# EAGLE design vco1_pots (EAGLE 7.4.0)
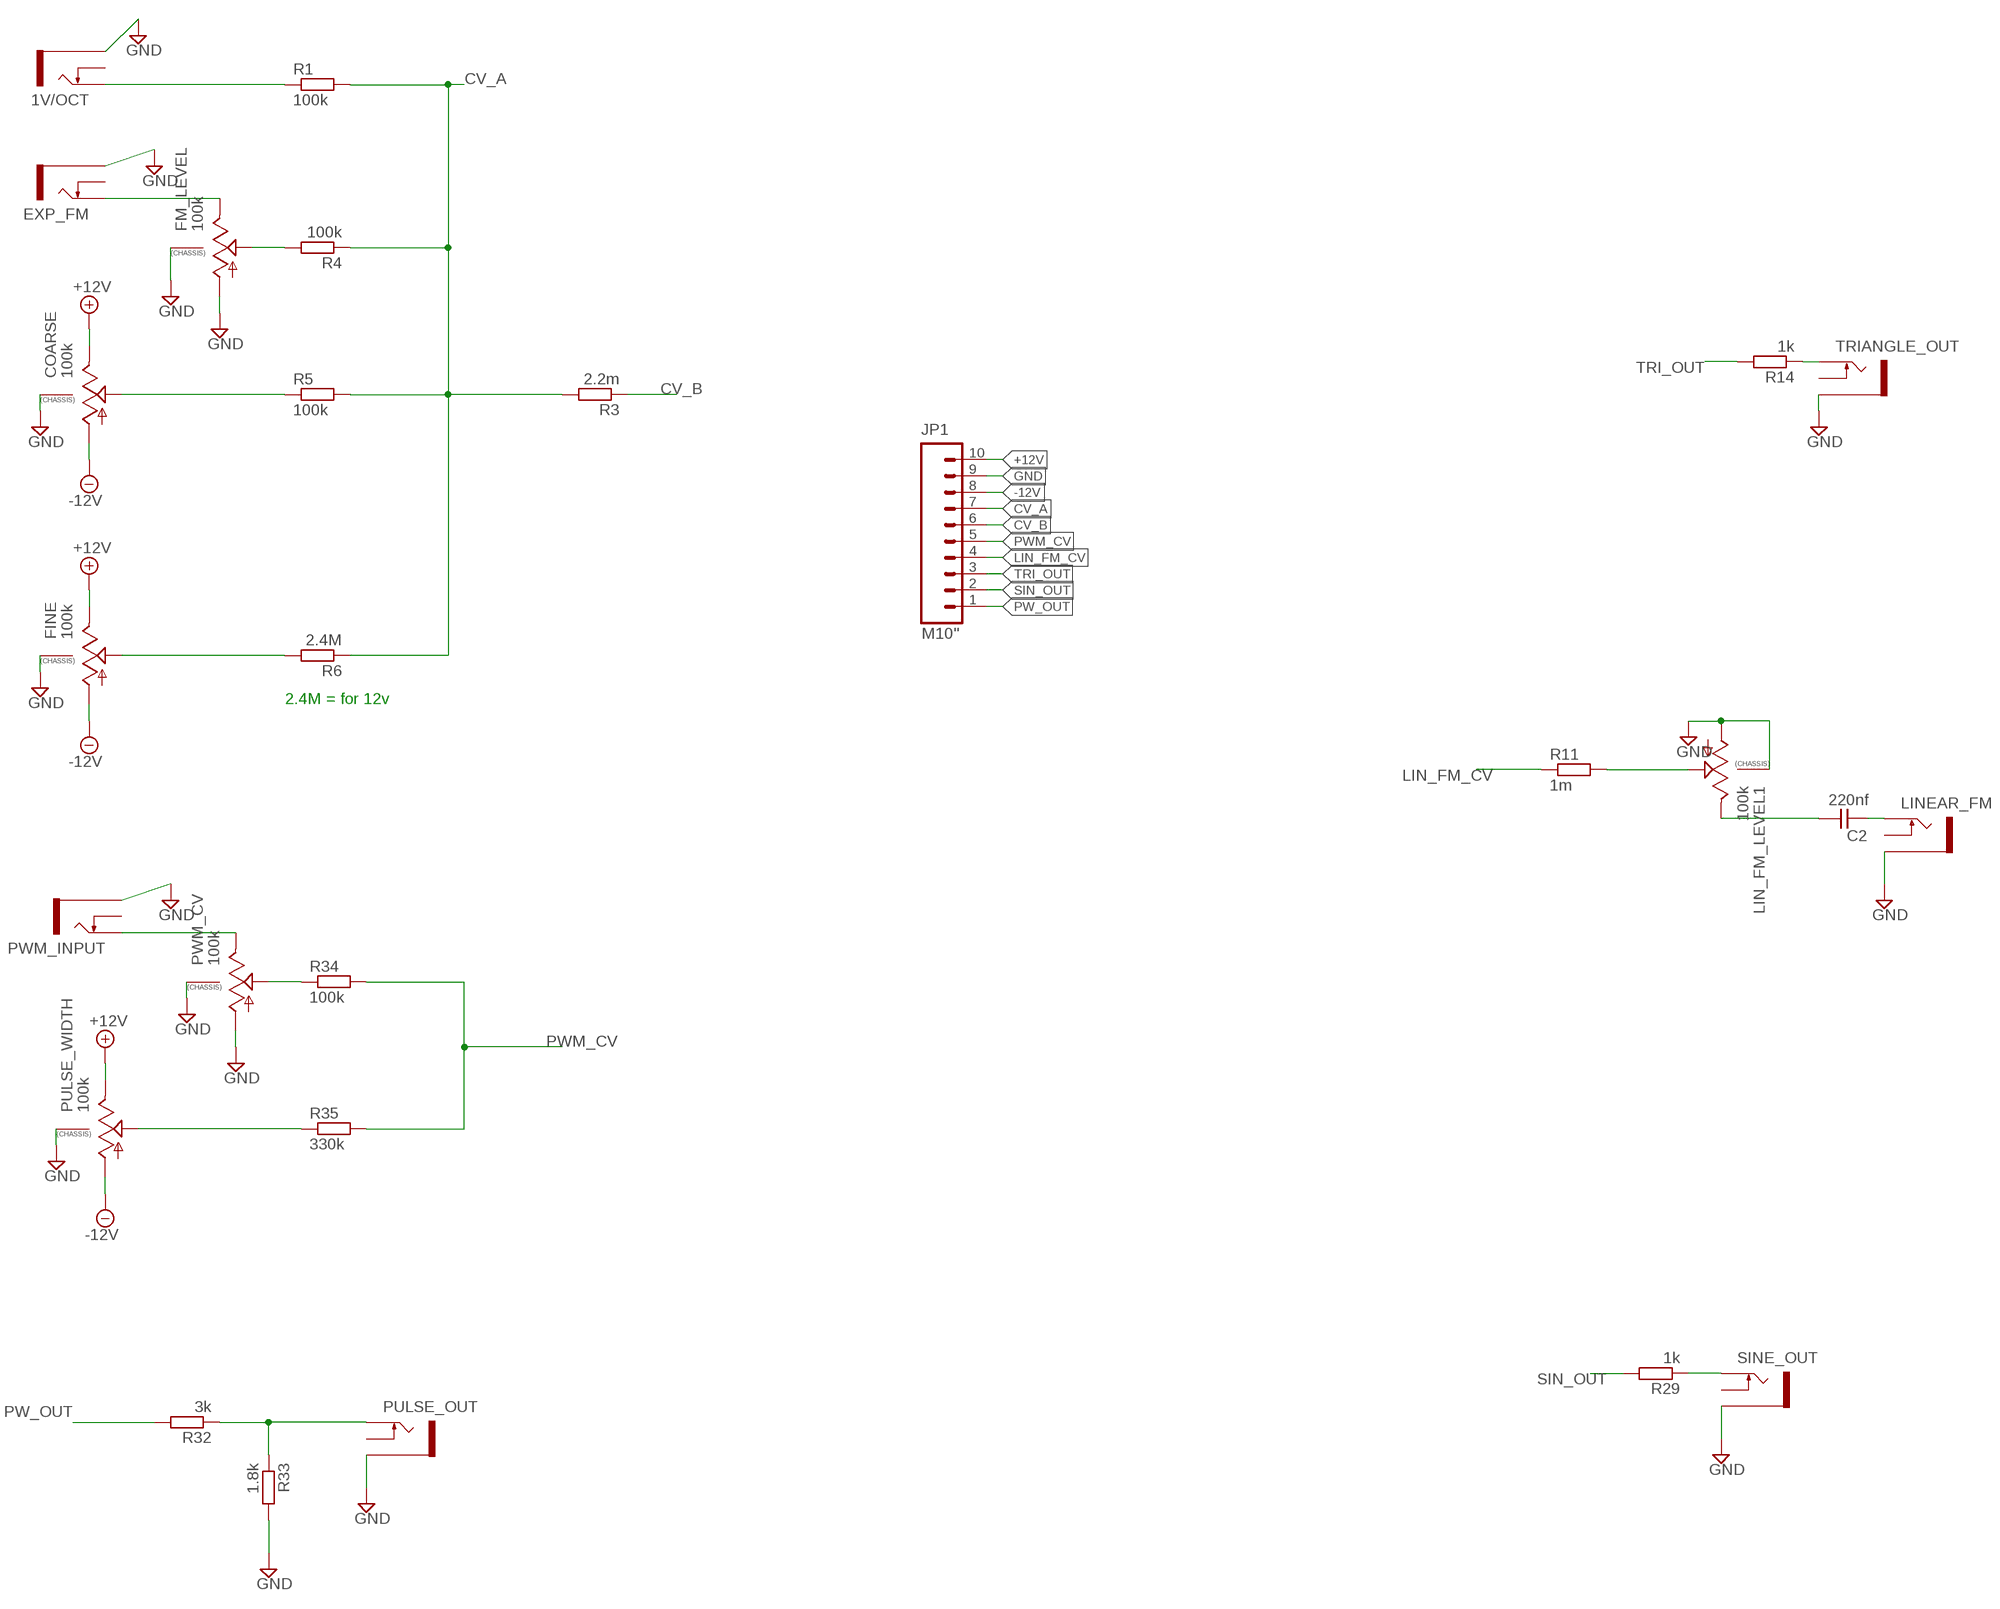
[diagram p0: schematic, sheet 1]

## Parts
1V/OCT  THONKICONNNEW  [WQP-PJ301M-12_JACK]
C2  220nf  C-EU050-024X044  [C050-024X044]
COARSE  100k  9MM_SNAP-IN_POT_CHASSIS  [9MM_SNAP-IN_POT]
EXP_FM  THONKICONNNEW  [WQP-PJ301M-12_JACK]
FINE  100k  9MM_SNAP-IN_POT_CHASSIS  [9MM_SNAP-IN_POT]
FM_LEVEL  100k  9MM_SNAP-IN_POT_CHASSIS  [9MM_SNAP-IN_POT]
JP1  M10"  [1X10]
LIN_FM_LEVEL1  100k  9MM_SNAP-IN_POT_CHASSIS  [9MM_SNAP-IN_POT]
LINEAR_FM  THONKICONNNEW  [WQP-PJ301M-12_JACK]
PULSE_OUT  THONKICONNNEW  [WQP-PJ301M-12_JACK]
PULSE_WIDTH  100k  9MM_SNAP-IN_POT_CHASSIS  [9MM_SNAP-IN_POT]
PWM_CV  100k  9MM_SNAP-IN_POT_CHASSIS  [9MM_SNAP-IN_POT]
PWM_INPUT  THONKICONNNEW  [WQP-PJ301M-12_JACK]
R1  100k  RESISTOR7MM  [7MM_RESISTOR]
R3  2.2m  RESISTOR7MM  [7MM_RESISTOR]
R4  100k  RESISTOR7MM  [7MM_RESISTOR]
R5  100k  RESISTOR7MM  [7MM_RESISTOR]
R6  2.4M  RESISTOR7MM  [7MM_RESISTOR]
R11  1m  RESISTOR7MM  [7MM_RESISTOR]
R14  1k  RESISTOR7MM  [7MM_RESISTOR]
R29  1k  RESISTOR7MM  [7MM_RESISTOR]
R32  3k  RESISTOR7MM  [7MM_RESISTOR]
R33  1.8k  RESISTOR7MM  [7MM_RESISTOR]
R34  100k  RESISTOR7MM  [7MM_RESISTOR]
R35  330k  RESISTOR7MM  [7MM_RESISTOR]
SINE_OUT  THONKICONNNEW  [WQP-PJ301M-12_JACK]
TRIANGLE_OUT  THONKICONNNEW  [WQP-PJ301M-12_JACK]

## Nets
+12V: COARSE.3(E) FINE.3(E) JP1.10 PULSE_WIDTH.3(E)
-12V: COARSE.1(A) FINE.1(A) JP1.8 PULSE_WIDTH.1(A)
CV_A: JP1.7 R1.2 R3.2 R4.1 R5.2 R6.1
CV_B: JP1.6 R3.1
GND: 1V/OCT.P$3_SLEEVE(SLEEVE) COARSE.CHASSIS2 EXP_FM.P$3_SLEEVE(SLEEVE) FINE.CHASSIS2 FM_LEVEL.1(A) FM_LEVEL.CHASSIS2 JP1.9 LIN_FM_LEVEL1.1(A) LIN_FM_LEVEL1.CHASSIS2 LINEAR_FM.P$3_SLEEVE(SLEEVE) PULSE_OUT.P$3_SLEEVE(SLEEVE) PULSE_WIDTH.CHASSIS2 PWM_CV.1(A) PWM_CV.CHASSIS2 PWM_INPUT.P$3_SLEEVE(SLEEVE) R33.2 SINE_OUT.P$3_SLEEVE(SLEEVE) TRIANGLE_OUT.P$3_SLEEVE(SLEEVE)
LIN_FM_CV: JP1.4 R11.1
N$1: 1V/OCT.P$1_TIP(TIP) R1.1
N$2: EXP_FM.P$1_TIP(TIP) FM_LEVEL.3(E)
N$3: FM_LEVEL.2(S) R4.2
N$4: COARSE.2(S) R5.1
N$5: FINE.2(S) R6.2
N$17: LIN_FM_LEVEL1.2(S) R11.2
N$18: R14.1 TRIANGLE_OUT.P$1_TIP(TIP)
N$19: C2.1 LIN_FM_LEVEL1.3(E)
N$20: C2.2 LINEAR_FM.P$1_TIP(TIP)
N$37: R29.1 SINE_OUT.P$1_TIP(TIP)
N$41: PULSE_OUT.P$1_TIP(TIP) R32.1 R33.1
N$42: PWM_CV.3(E) PWM_INPUT.P$1_TIP(TIP)
N$43: PWM_CV.2(S) R34.1
N$44: PULSE_WIDTH.2(S) R35.1
PW_OUT: JP1.1 R32.2
PWM_CV: JP1.5 R34.2 R35.2
SIN_OUT: JP1.2 R29.2
TRI_OUT: JP1.3 R14.2
Unconnected: 1V/OCT.P$2_SWITCH(SWITCH) EXP_FM.P$2_SWITCH(SWITCH) LINEAR_FM.P$2_SWITCH(SWITCH) PULSE_OUT.P$2_SWITCH(SWITCH) PWM_INPUT.P$2_SWITCH(SWITCH) SINE_OUT.P$2_SWITCH(SWITCH) TRIANGLE_OUT.P$2_SWITCH(SWITCH)

## Notes on the sheet
- 2.4M = for 12v

## Library data of the parts
1V/OCT EXP_FM LINEAR_FM PULSE_OUT PWM_INPUT SINE_OUT TRIANGLE_OUT = MusicThingModular:THONKICONN: 3.5mm socket for Eurorack modular synths
C2 = TomW:C-EU: CAPACITOR, European symbol
COARSE FINE FM_LEVEL LIN_FM_LEVEL1 PULSE_WIDTH PWM_CV = MusicThingModular:9MM_SNAP-IN_POT_CHASSIS: 9mm vertical snap-in pot, Alpha / Panasonic style, with a connection to the metal chassis for grounding
JP1 = SparkFun-Connectors:M10: Header 10 Standard 10-pin 0.1" header. Use with straight break away headers (SKU : PRT-00116), right angle break away headers (PRT-00553), swiss pins (PRT-00743), machine pins (PRT-00117), and female headers (PRT-00115).
R1 R3-R6 R11 R14 R29 R32-R35 = MusicThingModular:RESISTOR: Standard resistor, various versions

## Net classes
1 power: width 0.406 mm
2 ground: width 0.305 mm

## Board
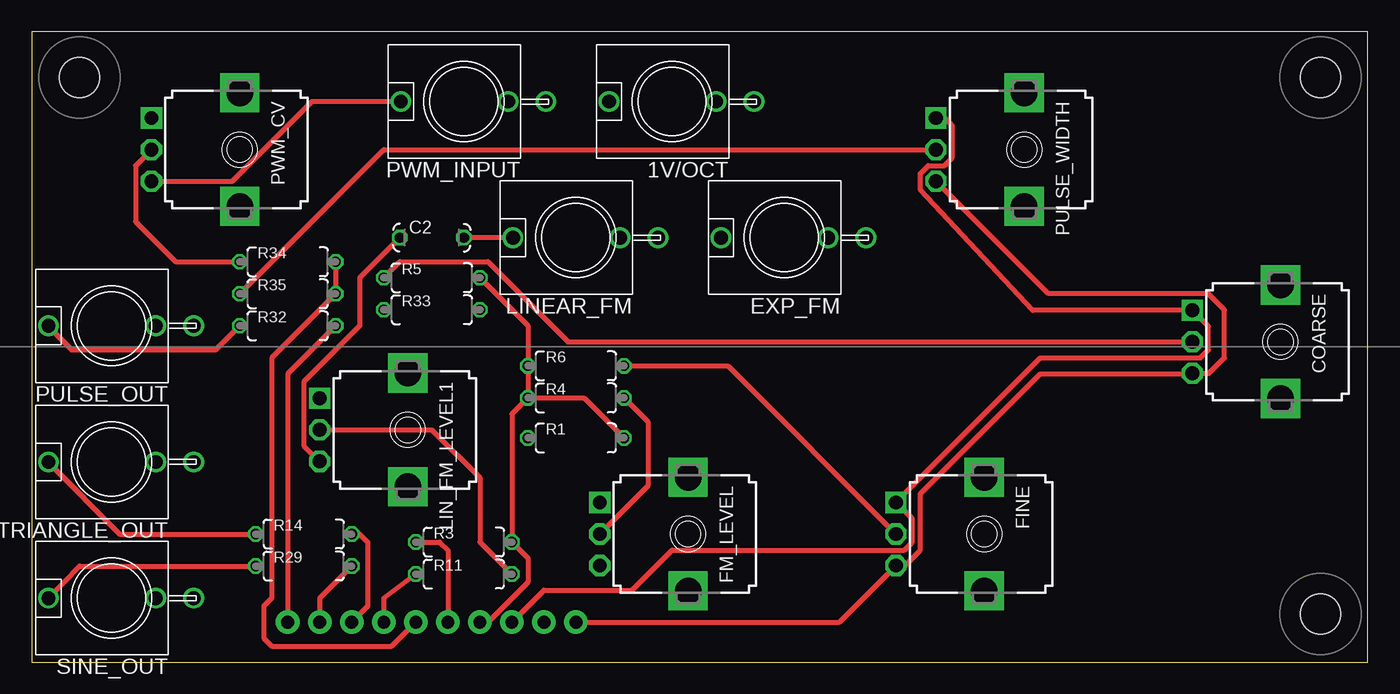
[diagram p1: board, top side]
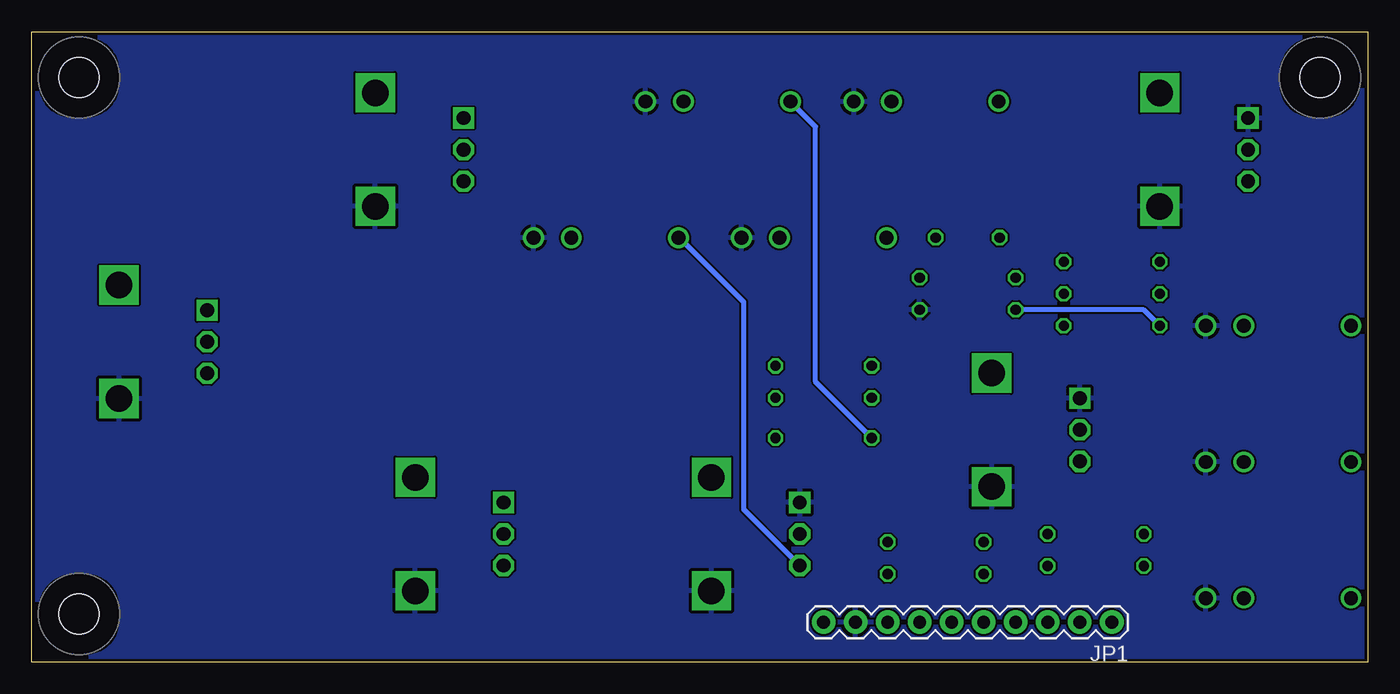
[diagram p2: board, bottom side, seen from below]

Size 106 x 50 mm. Coordinates in mm from the lower left corner, seen from the top.
Outline: 0,0 106,0 106,50 0,50 0,0
Copper layers (1*2*15*16): Top 0.035mm / dielectric 0.2mm / Route2 0.0175mm / dielectric 1.1mm / Route15 0.0175mm / dielectric 0.2mm / Bottom 0.035mm
Design rules "SeeedStudio_DRU_no_angle_20130527": minimum track width 6mil, minimum drill 12mil, track to track 6mil, track to pad 6mil, pad to pad 6mil, via to via 6mil, smd to smd 0mil, copper to edge 10mil, drill to drill 10mil, minimum pad ring 6mil, minimum via ring 6mil, stop-mask expansion 2mil, vias tented up to drill 25mil, thermal gap 10mil

### Footprints (pad centres in the part's own frame; a part is rotated, then mirrored left to right if it is on the bottom)
WQP-PJ301M-12_JACK = drill 1.1: P$1_TIP 0,5; P$2_SWITCH 0,-3.5; P$3_SLEEVE 0,-6.5
C050-024X044 = drill 0.813 octagon: 1 -2.54,0; 2 2.54,0
9MM_SNAP-IN_POT = drill 1.1 pad 1.676 square: 1 -2.5,-7 | drill 1.1 pad 1.676 octagon: 2 0,-7; 3 2.5,-7 | drill 2.1 pad 2.8 square: CHASSIS1 -4.5,0; CHASSIS2 4.5,0
1X10 = drill 1.016 pad 1.88: 1 0,0; 2 2.54,0; 3 5.08,0; 4 7.62,0; 5 10.16,0; 6 12.7,0; 7 15.24,0; 8 17.78,0; 9 20.32,0; 10 22.86,0
7MM_RESISTOR = drill 0.813 octagon: 1 -3.81,0; 2 3.81,0
MOUNTING_HOLE = hole 3.2: 0,0

### Placement (x,y rotation side)
1V/OCT  50.8,44.45 90 top
C2  31.75,33.66 0 top
COARSE  99.06,25.4 270 top
EXP_FM  59.69,33.66 90 top
FINE  75.56,10.16 270 top
FM_LEVEL  52.07,10.16 270 top
JP1  20.32,3.17 180 bottom
LIN_FM_LEVEL1  29.84,18.41 270 top
LINEAR_FM  43.18,33.66 90 top
PULSE_OUT  6.35,26.67 90 top
PULSE_WIDTH  78.74,40.64 270 top
PWM_CV  16.51,40.64 270 top
PWM_INPUT  34.29,44.45 90 top
R1  43.18,17.78 0 top
R3  34.29,9.53 0 top
R4  43.18,20.95 0 top
R5  31.75,30.48 0 top
R6  43.18,23.5 0 top
R11  34.29,6.99 0 top
R14  21.59,10.16 0 top
R29  21.59,7.62 0 top
R32  20.32,26.67 0 top
R33  31.75,27.94 0 top
R34  20.32,31.75 0 top
R35  20.32,29.21 0 top
SINE_OUT  6.35,5.08 90 top
TRIANGLE_OUT  6.35,15.88 90 top
U$1  [MOUNTING_HOLE]  3.81,46.35 0 top
U$2  [MOUNTING_HOLE]  102.23,3.81 0 top
U$3  [MOUNTING_HOLE]  102.23,46.35 0 top

### Tracks (layer width: path | path; a pad name or v marks a point on that pad's centre or on a via)
+12V
  Top 0.406: JP1.10 64.08,3.17 FINE.3 69.25,7.66 70.48,8.89 70.48,13.34 80.01,22.86 92.02,22.86 COARSE.3 93.39,22.9 94.61,24.13 94.61,27.94 93.34,29.21 80.67,29.21 PULSE_WIDTH.3 71.78,38.1
-12V
  Top 0.406: JP1.8 40.64,5.71 47.62,5.71 50.8,8.89 69.22,8.89 69.85,9.53 69.85,11.38 FINE.1 68.56,12.69 80.01,24.13 92.71,24.13 93.34,24.77 93.34,26.61 COARSE.1 79.42,27.9 70.48,37.47 70.48,38.73 71.12,39.37 72.39,39.37 73.03,40.01 73.03,42.55 72.39,43.18 71.78,43.18 PULSE_WIDTH.1
CV_A
  Top 0.406: R4.1 R6.1 39.37,26.67 R5.2 | JP1.7 36.2,3.17 39.37,6.35 39.37,8.26 R3.2 38.1,19.68 R4.1 | R4.1 43.81,20.95 R1.2
CV_B
  Top 0.406: R3.1 32.38,9.53 33.02,8.89 JP1.6
GND
  pour Bottom: -3.17,56.52 109.86,56.52 109.86,-4.45 -3.17,-4.45
LIN_FM_CV
  Top 0.406: R11.1 27.94,5.08 JP1.4
N$1
  Bottom 0.406: R1.1 43.81,22.23 43.81,42.47 1V/OCT.P$1_TIP
N$2
  Bottom 0.406: EXP_FM.P$1_TIP 54.61,33.66 49.53,28.57 49.53,12.12 FM_LEVEL.3
N$3
  Top 0.406: FM_LEVEL.2 48.9,13.98 48.9,19.05 R4.2
N$4
  Top 0.406: R5.1 29.21,31.75 36.2,31.75 42.55,25.4 COARSE.2
N$5
  Top 0.406: R6.2 55.23,23.5 FINE.2
N$17
  Top 0.406: LIN_FM_LEVEL1.2 31.75,18.41 35.56,14.61 35.56,9.53 R11.2
N$18
  Top 0.406: TRIANGLE_OUT.P$1_TIP 1.35,15.79 6.99,10.16 R14.1
N$19
  Top 0.406: C2.1 26.04,30.48 26.04,26.67 21.59,22.23 21.59,17.17 LIN_FM_LEVEL1.3
N$20
  Top 0.406: LINEAR_FM.P$1_TIP C2.2
N$37
  Top 0.406: SINE_OUT.P$1_TIP 3.81,7.62 R29.1
N$41
  Top 0.406: PULSE_OUT.P$1_TIP 1.35,26.59 3.17,24.77 14.61,24.77 R32.1
  Bottom 0.406: R32.1 17.78,27.94 R33.1
N$42
  Top 0.406: PWM_INPUT.P$1_TIP 22.23,44.45 15.88,38.1 9.47,38.1 PWM_CV.3
N$43
  Top 0.406: PWM_CV.2 9.53,40.64 8.26,39.37 8.26,34.92 11.43,31.75 R34.1
N$44
  Top 0.406: R35.1 27.94,40.64 PULSE_WIDTH.2
PW_OUT
  Top 0.406: R32.2 20.32,22.86 JP1.1
PWM_CV
  Top 0.406: R34.2 R35.2 19.05,24.13 19.05,5.08 18.41,4.45 18.41,1.91 19.05,1.27 28.57,1.27 JP1.5
SIN_OUT
  Top 0.406: R29.2 22.86,5.08 JP1.2
TRI_OUT
  Top 0.406: R14.2 26.04,10.16 26.67,9.53 26.67,4.45 JP1.3